# EasyEDA Pro project 交通信号灯第一版.epro

# Schematic CORE
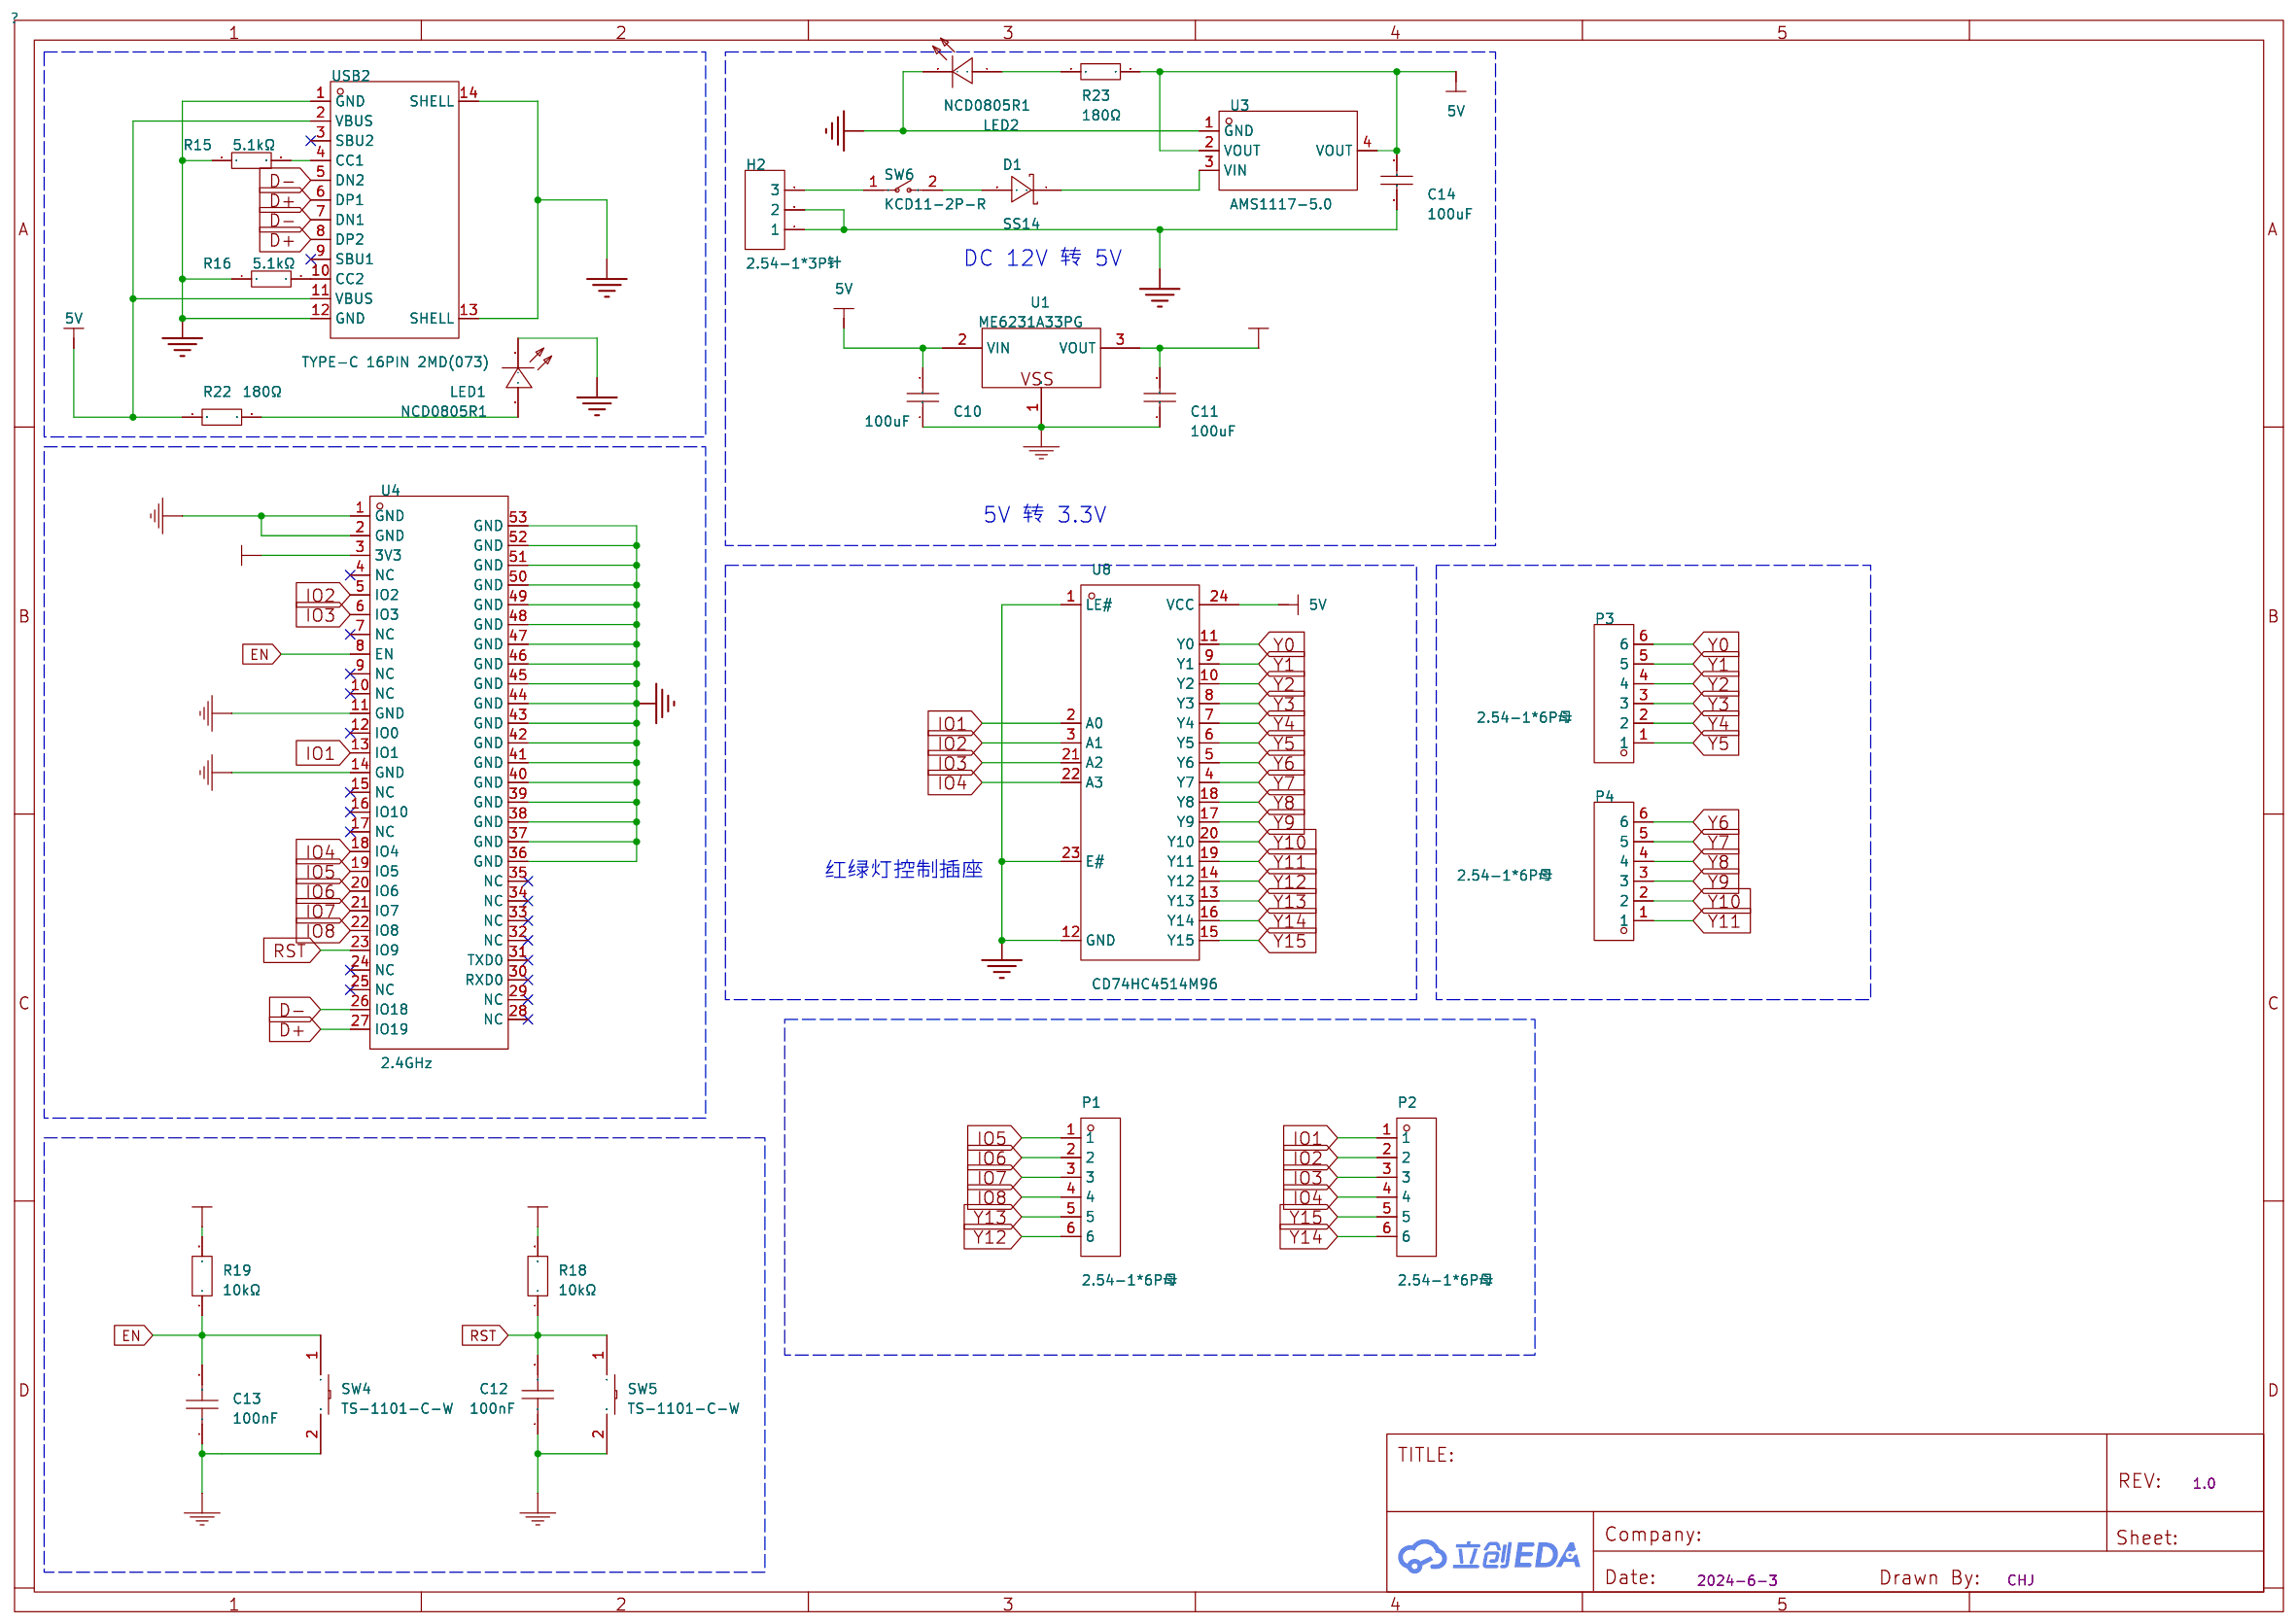
[diagram p0: schematic sheet]

## Parts
C10  100uF  [C1206]
C11  100uF  [C1206]
C12  100nF  [C0603]
C13  100nF  [C0603]
C14  100uF  [C1206]
D1  SS14  [SMA_L4.2-W2.6-LS5.3-RD]
H2  2.54-1*3P针  [HDR-TH_3P-P2.54-V-M-1]
LED1  NCD0805R1  [LED0805-R-RD]
LED2  NCD0805R1  [LED0805-R-RD]
P1  2.54-1*6P母  [HDR-TH_6P-P2.54-V-F]
P2  2.54-1*6P母  [HDR-TH_6P-P2.54-V-F]
P3  2.54-1*6P母  [HDR-TH_6P-P2.54-V-F]
P4  2.54-1*6P母  [HDR-TH_6P-P2.54-V-F]
R15  5.1kΩ  [R0603]
R16  5.1kΩ  [R0603]
R18  10kΩ  [R0603]
R19  10kΩ  [R0603]
R22  180Ω  [R0805]
R23  180Ω  [R0805]
SW4  TS-1101-C-W  [SW-SMD_L6.0-W3.3-LS8.0]
SW5  TS-1101-C-W  [SW-SMD_L6.0-W3.3-LS8.0]
SW6  KCD11-2P-R  [SW-TH_2P-L15.0-W10.5-P5.00_KCD11-2P-R]
U1  ME6231A33PG  [SOT-89-3_L4.5-W2.5-P1.50-LS4.2-BR]
U3  AMS1117-5.0  [SOT-223_L6.5-W3.5-P2.30-LS7.0-BR]
U4  2.4GHz  [WIFIM-SMD_ESP32-C3-MINI-1]
U8  CD74HC4514M96  [SOIC-24_L15.4-W7.5-P1.27-LS10.3-BL]
USB2  TYPE-C 16PIN 2MD(073)  [USB-C-SMD_TYPE-C-6PIN-2MD-073]

## Library data of the parts
C10 C11 C14 = CL31A107MQHNNNE: 容值:100uF;精度:±20%;额定电压:6.3V;材质(温度系数):X5R;; LCSC Part Name: 100uF ±20% 6.3V; Supplier Part: C15008; Manufacturer: SAMSUNG(三星); Supplier Footprint: 1206; JLCPCB Part Class: 基础库; Datasheet: https://atta.szlcsc.com/upload/public/pdf/source/20160218/1457707763339.pdf; Supplier: LCSC; Tolerance: ±20%; Voltage Rated: 6.3V; Temperature Coefficient: X5R
C12 C13 = CC0603KRX7R9BB104: 容值:100nF;精度:±10%;额定电压:50V;材质(温度系数):X7R;; LCSC Part Name: 100nF ±10% 50V; Supplier Part: C14663; Manufacturer: YAGEO(国巨); Supplier Footprint: 0603; JLCPCB Part Class: 基础库; Datasheet: https://atta.szlcsc.com/upload/public/pdf/source/20180910/C282072_33301C7F631E79921B82A8DAC6BCC5B3.pdf; Supplier: LCSC; Tolerance: ±10%; Voltage Rated: 50V; Temperature Coefficient: X7R
D1 = SS14_C2480: 二极管配置:独立式;正向压降(Vf):550mV@1A;直流反向耐压(Vr):40V;平均整流电流(Io):1A;; LCSC Part Name: 电压:40V 电流:1A; Supplier Part: C2480; Manufacturer: MDD; Supplier Footprint: SMA(DO-214AC); JLCPCB Part Class: 基础库; Datasheet: https://atta.szlcsc.com/upload/public/pdf/source/20230712/2DB6064CFBB99DE6DB116BEE8208BE66.pdf; Supplier: LCSC; Diode Configuration: 独立式; Forward Voltage (Vf@If): 550mV@1A; Reverse Voltage (Vr): 40V; Average Rectified Current (Io): 1A; Reverse Leakage Current (Ir): 500uA@40V
H2 = 2.54-1*3P针: 插针结构:1x3P;间距:2.54mm;行距:-;圆针/方针:方针;安装类型:直插;排数:单排;总PIN位数:3P;额定电流:3A;额定电压:-;配合针长度:-;塑高:-;端接针长度:-;触头材质:-;触头镀层:-;工作温度范围:-40℃~+105℃;颜色:黑色;; LCSC Part Name: 间距:2.54mm 1x3P 直插 方针; Supplier Part: C49257; Manufacturer: BOOMELE(博穆精密); Supplier Footprint: 插件,P=2.54mm; JLCPCB Part Class: 扩展库; Datasheet: https://atta.szlcsc.com/upload/public/pdf/source/20221018/3E9408392E35E6F57A28985E5F7BF5C9.pdf; Supplier: LCSC; Pin Structure: 1x3P; Pitch: 2.54mm; Circluar Pins/Square Pins: 方针; Mounting Type: 直插; Number of Rows: 单排; Number of Pins: 3P; Current Rating (Max): 3A; Operating Temperature Range: -40℃~+105℃; Color: 黑色
LED1 LED2 = NCD0805R1: 灯头类型:-;发光颜色:红色;正向电压(VF):1.6V~2.6V;功率:65mW;正向电流:20mA;主波长:615nm~630nm;二极管配置:独立二极管;透镜颜色:无色透明透镜;色温:-;发光强度:67mcd~195mcd;发光角度:130°;载带方式:-;工作温度:-30℃~+85℃;; Supplier Part: C84256; Manufacturer: 国星光电; Supplier Footprint: 0805; JLCPCB Part Class: 基础库; Datasheet: https://atta.szlcsc.com/upload/public/pdf/source/20200820/C84256_F0A75A43B3EAD75808600A0514C76B99.pdf; Supplier: LCSC; Emitted Color: 红色; Forward Voltage (VF): 1.6V~2.6V; Power Dissipation: 65mW; Forward Current: 20mA; Dominant Wavelength: 615nm~630nm; Diode Configuration: 独立二极管; Lens Color: 无色透明透镜; Luminous Intensity: 67mcd~195mcd; Viewing Angle: 130°; Operating Temperature: -30℃~+85℃
P1-P4 = 2.54-1*6P母: 插孔结构:1x6P;间距:2.54mm;行距:-;安装类型:直插;排数:单排;总孔位数:6P;塑高:-;触头材质:-;触头镀层:-;; LCSC Part Name: 间距:2.54mm 1x6P 直插; Supplier Part: C40877; Manufacturer: BOOMELE(博穆精密); Supplier Footprint: 插件,P=2.54mm; JLCPCB Part Class: 扩展库; Datasheet: https://atta.szlcsc.com/upload/public/pdf/source/20210301/C2718488_F4427B881E42CAA8DDB0B1C12B3A522C.pdf; Supplier: LCSC; Holes Structure: 1x6P; Pitch: 2.54mm; Mounting Type: 直插; Number of Rows: 单排; Number of Holes: 6P
R15 R16 = 0603WAF5101T5E: 电阻类型:厚膜电阻;阻值:5.1kΩ;精度:±1%;功率:100mW;最大工作电压:75V;温度系数:±100ppm/℃;; LCSC Part Name: 5.1kΩ ±1% 100mW 厚膜电阻; Supplier Part: C23186; Manufacturer: UNI-ROYAL(厚声); Supplier Footprint: 0603; JLCPCB Part Class: 基础库; Datasheet: https://atta.szlcsc.com/upload/public/pdf/source/20200306/C422600_1E6D84923E4A46A82E41ADD87F860B5C.pdf; Supplier: LCSC; Type: 厚膜电阻; Tolerance: ±1%; Power(Watts): 100mW; Overload Voltage (Max): 75V; Temperature Coefficient: ±100ppm/℃; Operating Temperature Range: -55℃~+155℃
R18 R19 = FRC0603J103TS: 电阻类型:厚膜电阻;阻值:10kΩ;精度:±5%;功率:100mW;最大工作电压:75V;温度系数:±100ppm/℃;; LCSC Part Name: 10kΩ ±5% 100mW 厚膜电阻; Supplier Part: C2930027; Manufacturer: FOJAN(富捷); Supplier Footprint: 0603; JLCPCB Part Class: 扩展库; Datasheet: https://atta.szlcsc.com/upload/public/pdf/source/20211221/925EC7D7225764EE0046F22065062C87.pdf; Supplier: LCSC; Type: 厚膜电阻; Tolerance: ±5%; Power(Watts): 100mW; Overload Voltage (Max): 75V; Temperature Coefficient: ±100ppm/℃; Operating Temperature Range: -55℃~+155℃
R22 R23 = 0805W8F1800T5E: 电阻类型:厚膜电阻;阻值:180Ω;精度:±1%;功率:125mW;最大工作电压:150V;温度系数:±100ppm/℃;; LCSC Part Name: 180Ω ±1% 125mW 厚膜电阻; Supplier Part: C25270; Manufacturer: UNI-ROYAL(厚声); Supplier Footprint: 0805; JLCPCB Part Class: 扩展库; Datasheet: https://atta.szlcsc.com/upload/public/pdf/source/20200306/C422600_1E6D84923E4A46A82E41ADD87F860B5C.pdf; Supplier: LCSC; Type: 厚膜电阻; Tolerance: ±1%; Power(Watts): 125mW; Overload Voltage (Max): 150V; Temperature Coefficient: ±100ppm/℃; Operating Temperature Range: -55℃~+155℃
SW4 SW5 = TS-1101-C-W: 电路结构:单刀单掷;按钮形状:矩形按钮;作用力:260gf;安装方式:立贴;开关长度:6mm;开关宽度:3.6mm;开关高度:2.5mm;带支架:不带;触点电流:50mA;额定电压(AC):-;额定电压(DC):12V;额定功率:-;绝缘电阻:-;带灯:无;机械寿命:5万次;; LCSC Part Name: 6*3.6*2.5mm 立贴 轻触开关; Supplier Part: C318938; Manufacturer: XKB Connectivity(中国星坤); Supplier Footprint: SMD; JLCPCB Part Class: 扩展库; Datasheet: https://atta.szlcsc.com/upload/public/pdf/source/20200227/C318938_C2E53B1EEDE37D980A33616AC086DE53.pdf; Supplier: LCSC; Circuit: 单刀单掷; Actuator Style: 矩形按钮; Operating Force: 260gf; Mounting Style: 立贴; Switch Length: 6mm; Switch Width: 3.6mm; Switch Height: 2.5mm; Strike Gundam: 不带; Contact Current: 50mA; Voltage Rating (DC): 12V; Actuator/Cap Color: 白色带淡绿; With Lamp: 无; Mechanical Life: 5万次; Operating Temperature: -30℃~+85℃
SW6 = KCD11-2P-R: 带灯:无;引脚样式:焊片;额定电流:3A;额定电压(AC):250V;额定电压(DC):-;电路结构:单刀单掷;机械寿命:1万次;; LCSC Part Name: 10.5*15mm 两脚两档跷板开关 红钮; Supplier Part: C5884414; Manufacturer: SHOU HAN(首韩); Supplier Footprint: 插件; JLCPCB Part Class: 扩展库; Datasheet: https://atta.szlcsc.com/upload/public/pdf/source/20230506/CD06DFDE35C8048D34175BFF4AF6A2C2.pdf; Supplier: LCSC; Switch Length: 15mm; Switch Width: 10.5mm; Switch Height: 17.2mm; Actuator Type: 凹面弯曲; With Lamp: 无; Pin Style: 焊片; Actuator Color: 红色; Contact Current: 3A; Voltage Rating (AC): 250V; Circuit: 单刀单掷; Mechanical Life: 1万次; Operating Temperature: 0℃~+125℃; Actuator Identifier: - O
U1 = ME6231A33PG: Supplier: LCSC; Supplier Part: C2681684; Manufacturer: MICRONE(南京微盟); JLCPCB Part Class: Extended Part
U3 = AMS1117-5.0_C6187: 输出类型:固定;最大输入电压:12V;输出电压:5V;最大输出电流:1A;电源纹波抑制比(PSRR):68dB@(120Hz);输出极性:正极;; LCSC Part Name: 输入12V 输出5V 1A; Supplier Part: C6187; Manufacturer: AMS; Supplier Footprint: SOT-223; JLCPCB Part Class: 基础库; Datasheet: https://atta.szlcsc.com/upload/public/pdf/source/20230918/E4B716057EE82179D88E8A0894830D59.pdf; Supplier: LCSC; Output Type: 固定; Maximum Input Voltage: 12V; Output Voltage: 5V; MAX Output Current: 1A; Power Supply Rejection Ratio (PSRR): 68dB@(120Hz); Dropout Voltage: 1.3V@(1A); Output Polarity: 正极; Number of Outputs: 1
U4 = ESP32-C3-MINI-1-H4: 核心处理器:-;频率:2.4GHz;天线形式:板载PCB天线;发射功率:20.5dBm;接收灵敏度:-96dBm;; Supplier Part: C2934569; Manufacturer: ESPRESSIF(乐鑫); Supplier Footprint: SMD,13.2x16.6mm; JLCPCB Part Class: 扩展库; Datasheet: https://atta.szlcsc.com/upload/public/pdf/source/20211222/4A6E563D9536B67D492463D36DD57C1D.pdf; Supplier: LCSC; Support Interface: SPI; Antenna Type: 板载PCB天线; Output Power: 20.5dBm; Operating Voltage: 3.3V; Sensitivity: -96dBm; Operating Temperature: -40℃~+85℃
U8 = CD74HC4514M96: 供电电压:2V~6V;灌电流(IOL):5.2mA;拉电流(IOH):5.2mA;; Supplier Part: C6549; Manufacturer: TI(德州仪器); Supplier Footprint: SOIC-24-300mil; JLCPCB Part Class: 扩展库; Datasheet: https://www.ti.com/cn/lit/gpn/cd74hc4514; Supplier: LCSC; Type: 解码器/多路分解器; Voltage Supply Source: 单电源; Supply Voltage: 2V~6V; Sink Current: 5.2mA; Source Current: 5.2mA; Operating temperature: -55℃~+125℃
USB2 = TYPE-C 16PIN 2MD(073): 连接器类型:Type-C;标准:-;公母:母;端口数量:1;触点数量:16P;安装方式:卧贴;额定电流 - 电源:5A;工作温度范围:-25℃~+85℃;; LCSC Part Name: Type-C 母 卧贴; Supplier Part: C2765186; Manufacturer: SHOU HAN(首韩); Supplier Footprint: SMD; JLCPCB Part Class: 扩展库; Datasheet: https://atta.szlcsc.com/upload/public/pdf/source/20211123/39B17C16241EAC15C5E277BDA434118E.pdf; Supplier: LCSC; Connector Type: Type-C; Gender: 母; Number of Ports: 1; Number of Contacts: 16P; Mounting Style: 卧贴; Current Rating - Power (Max): 5A; Operating Temperature Range: -25℃~+85℃

## Nets
3.3V: C11.2 R18.2 R19.2 U1.3(VOUT) U4.3(3V3)
5V: C10.2 C14.2 R22.1 R23.2 U1.2(VIN) U3.2(VOUT) U3.4(VOUT) U8.24(VCC) USB2.2(VBUS) USB2.11(VBUS)
GND: C10.1 C11.1 C12.1 C13.1 C14.1 H2.1 H2.2 LED1.2(-) LED2.2(-) R15.1 R16.1 SW4.2 SW5.2 U1.1(VSS) U3.1(GND) U4.1(GND) U4.2(GND) U4.11(GND) U4.14(GND) U4.36(GND) U4.37(GND) U4.38(GND) U4.39(GND) U4.40(GND) U4.41(GND) U4.42(GND) U4.43(GND) U4.44(GND) U4.45(GND) U4.46(GND) U4.47(GND) U4.48(GND) U4.49(GND) U4.50(GND) U4.51(GND) U4.52(GND) U4.53(GND) U8.1(LE#) U8.12(GND) U8.23(E#) USB2.1(GND) USB2.12(GND) USB2.13(SHELL) USB2.14(SHELL)
D+: U4.27(IO19) USB2.6(DP1) USB2.8(DP2)
D-: U4.26(IO18) USB2.5(DN2) USB2.7(DN1)
EN: C13.2 R19.1 SW4.1 U4.8(EN)
IO1: P2.1 U4.13(IO1) U8.2(A0)
IO2: P2.2 U4.5(IO2) U8.3(A1)
IO3: P2.3 U4.6(IO3) U8.21(A2)
IO4: P2.4 U4.18(IO4) U8.22(A3)
IO5: P1.1 U4.19(IO5)
IO6: P1.2 U4.20(IO6)
IO7: P1.3 U4.21(IO7)
IO8: P1.4 U4.22(IO8)
RST: C12.2 R18.1 SW5.1 U4.23(IO9)
Y0: P3.6 U8.11(Y0)
Y1: P3.5 U8.9(Y1)
Y2: P3.4 U8.10(Y2)
Y3: P3.3 U8.8(Y3)
Y4: P3.2 U8.7(Y4)
Y5: P3.1 U8.6(Y5)
Y6: P4.6 U8.5(Y6)
Y7: P4.5 U8.4(Y7)
Y8: P4.4 U8.18(Y8)
Y9: P4.3 U8.17(Y9)
Y10: P4.2 U8.20(Y10)
Y11: P4.1 U8.19(Y11)
Y12: P1.6 U8.14(Y12)
Y13: P1.5 U8.13(Y13)
Y14: P2.6 U8.16(Y14)
Y15: P2.5 U8.15(Y15)
$1N7275: R15.2 USB2.4(CC1)
$1N7277: R16.2 USB2.10(CC2)
$1N9476: LED1.1(+) R22.2
$1N10832: H2.3 SW6.1
$1N11019: LED2.1(+) R23.1
$1N19881: D1.1(K) U3.3(VIN)
$1N19882: D1.2(A) SW6.2

Not connected (* = marked no-connect by the designer): U4 4(NC)* 7(NC)* 9(NC)* 10(NC)* 12(IO0)* 15(NC)* 16(IO10)* 17(NC)* 24(NC)* 25(NC)* 28(NC)* 29(NC)* 30(RXD0)* 31(TXD0)* 32(NC)* 33(NC)* 34(NC)* 35(NC)*; USB2 3(SBU2)* 9(SBU1)*

## Notes on the sheet
- DC 12V 转 5V
- 5V 转 3.3V
- 红绿灯控制插座

# Board CORE
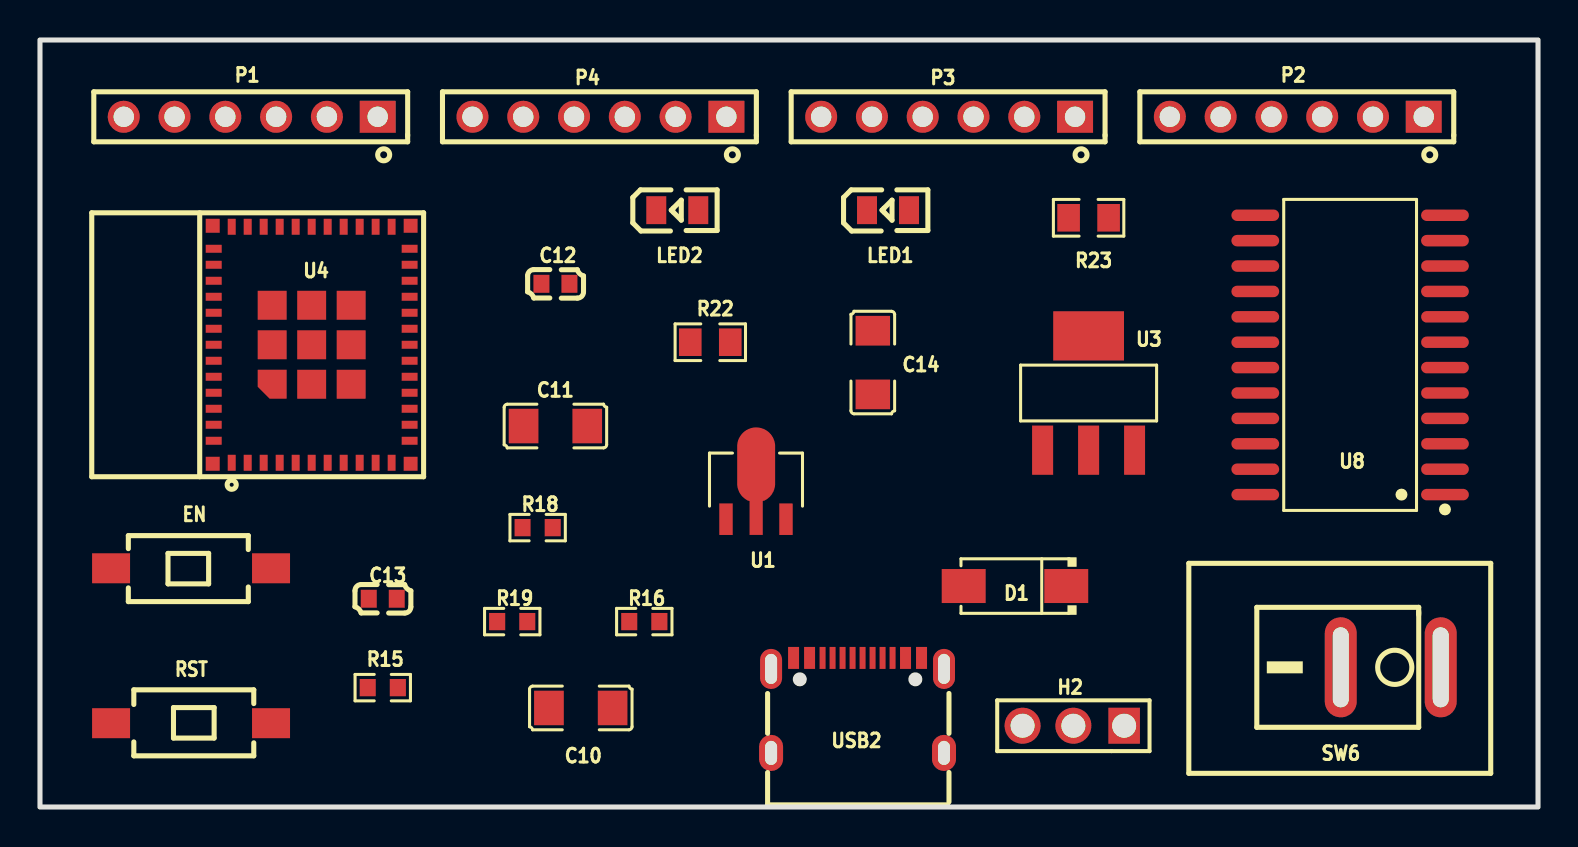
[diagram p1: board, top side]
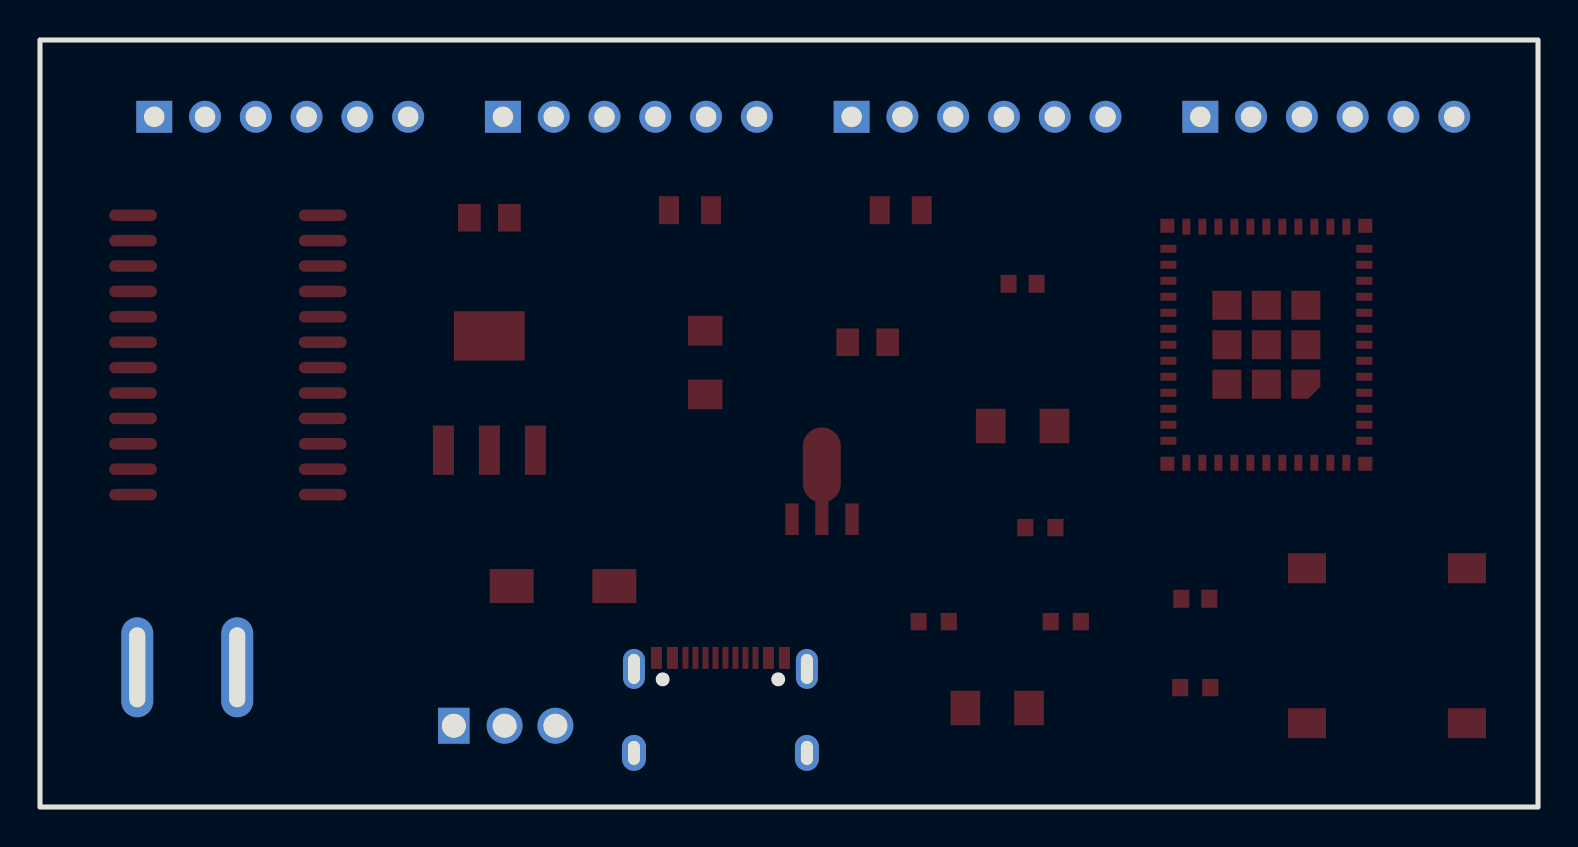
[diagram p2: board, bottom side, seen from below]

Outline 74.93 x 38.35 mm; copper layers: Top Layer, Bottom Layer. Coordinates in mm from the lower left corner of the outline.
Outline path: rectangle 0,38.35 74.93,0
Stack: Top Layer 0.035mm / Dielectric1 1.51mm FR4 er 4.5 / Bottom Layer 0.035mm

## Design rules (mm)
spacing Default (default): track to track 0.152, other pairs 0 to 0.152
track width Default (default): min 0.254, default 0.254, max 25.4
differential pair differentialPair (default): width min 0.127, default 0.254, max 2.54; gap min 0.152, default 0.152
via Default (default): diameter min 0.61, default 0.61, max 100.025; hole min 0.305, default 0.305, max 59.995
net GND uses gge33061

## Placement (name value [footprint] x y rotation side)
C10  100uF  [C1206]  27.05 4.95 0 top
C11  100uF  [C1206]  25.78 19.05 0 top
C12  100nF  [C0603]  25.78 26.16 180 top
C13  100nF  [C0603]  17.14 10.41 180 top
C14  100uF  [C1206]  41.66 22.22 270 top
D1  SS14  [SMA_L4.2-W2.6-LS5.3-RD]  48.77 11.05 180 top
H2  2.54-1*3P针  [HDR-TH_3P-P2.54-V-M-1]  51.69 4.06 180 top
LED1  NCD0805R1  [LED0805-R-RD]  42.42 29.84 0 top
LED2  NCD0805R1  [LED0805-R-RD]  31.88 29.84 0 top
P1  2.54-1*6P母  [HDR-TH_6P-P2.54-V-F]  10.54 34.51 180 top
P2  2.54-1*6P母  [HDR-TH_6P-P2.54-V-F]  62.86 34.51 180 top
P3  2.54-1*6P母  [HDR-TH_6P-P2.54-V-F]  45.42 34.51 180 top
P4  2.54-1*6P母  [HDR-TH_6P-P2.54-V-F]  27.98 34.51 180 top
R15  5.1kΩ  [R0603]  17.14 5.97 0 top
R16  5.1kΩ  [R0603]  30.23 9.27 0 top
R18  10kΩ  [R0603]  24.89 13.97 0 top
R19  10kΩ  [R0603]  23.62 9.27 0 top
R22  180Ω  [R0805]  33.53 23.24 180 top
R23  180Ω  [R0805]  52.45 29.46 180 top
SW4  TS-1101-C-W  [SW-SMD_L6.0-W3.3-LS8.0]  7.56 11.94 0 top
SW5  TS-1101-C-W  [SW-SMD_L6.0-W3.3-LS8.0]  7.56 4.19 180 top
SW6  KCD11-2P-R  [SW-TH_2P-L15.0-W10.5-P5.00_KCD11-2P-R]  67.56 6.98 180 top
U1  ME6231A33PG  [SOT-89-3_L4.5-W2.5-P1.50-LS4.2-BR]  35.81 15.75 270 top
U3  AMS1117-5.0  [SOT-223_L6.5-W3.5-P2.30-LS7.0-BR]  52.45 20.7 270 top
U4  2.4GHz  [WIFIM-SMD_ESP32-C3-MINI-1]  13.59 23.11 90 top
U8  CD74HC4514M96  [SOIC-24_L15.4-W7.5-P1.27-LS10.3-BL]  65.53 22.61 90 top
USB2  TYPE-C 16PIN 2MD(073)  [USB-C-SMD_TYPE-C-6PIN-2MD-073]  40.89 5.08 0 top

## Footprints (pads in the part's own frame, mm; a bottom-side part is the same pattern mirrored in y, then rotated)
C0603
  rect 0.8x0.9 smd: 1(-0.7,0) 2(0.7,0)
C1206
  rect 1.485x1.728 smd: 1(-1.593,0) 2(1.593,0)
HDR-TH_3P-P2.54-V-M-1
  rect 1.575x1.8 hole 1.2: 1(-2.54,0)
  round 1.8 hole 1.2: 2(0,0) 3(2.54,0)
HDR-TH_6P-P2.54-V-F
  rect 1.8x1.6 hole 1.02: 1(-6.35,0)
  round 1.6 hole 1.02: 2(-3.81,0) 3(-1.27,0) 4(1.27,0) 5(3.81,0) 6(6.35,0)
LED0805-R-RD
  rect 1x1.399 smd: 1(1.05,0) 2(-1.05,0)
R0603
  rect 0.806x0.864 smd: 1(-0.753,0) 2(0.753,0)
R0805
  rect 1.133x1.377 smd: 1(-1,0) 2(1,0)
SMA_L4.2-W2.6-LS5.3-RD
  rect 2.2x1.7 smd: 1(-2.566,0) 2(2.566,0)
SOIC-24_L15.4-W7.5-P1.27-LS10.3-BL
  oval 0.574x2.388 smd: 1(-6.985,-4.744) 2(-5.715,-4.744) 3(-4.445,-4.744) 4(-3.175,-4.744) 5(-1.905,-4.744) 6(-0.635,-4.744) 7(0.635,-4.744) 8(1.905,-4.744) 9(3.175,-4.744) 10(4.445,-4.744) 11(5.715,-4.744) 12(6.985,-4.744) 13(6.985,4.744) 14(5.715,4.744) 15(4.445,4.744) 16(3.175,4.744) 17(1.905,4.744) 18(0.635,4.744) 19(-0.635,4.744) 20(-1.905,4.744) 21(-3.175,4.744) 22(-4.445,4.744) 23(-5.715,4.744) 24(-6.985,4.744)
SOT-89-3_L4.5-W2.5-P1.50-LS4.2-BR
  rect 1.575x0.672 smd: 1(1.357,-1.5) 3(1.357,1.5)
  custom 5.377x1.9 smd: 2(-1.356,0.009)
SOT-223_L6.5-W3.5-P2.30-LS7.0-BR
  rect 2.465x1.05 smd: 1(2.857,-2.3) 2(2.857,0) 3(2.857,2.3)
  rect 2.465x3.54 smd: 4(-2.857,0)
SW-SMD_L6.0-W3.3-LS8.0
  rect 1.9x1.5 smd: 1(-4,0) 2(4,0)
SW-TH_2P-L15.0-W10.5-P5.00_KCD11-2P-R
  oval 1.6x5 hole 0.8x4: 1(-2.5,0) 2(2.5,0)
USB-C-SMD_TYPE-C-6PIN-2MD-073
  rect 0.55x1.1 smd: 1(-3.2,2.375) 2(-2.4,2.375) 11(2.4,2.375) 12(3.2,2.375)
  rect 0.3x1.1 smd: 3(-1.75,2.375) 4(-1.25,2.375) 5(-0.75,2.375) 6(-0.25,2.375) 7(0.25,2.375) 8(0.75,2.375) 9(1.25,2.375) 10(1.75,2.375)
  oval 1.1x2 hole 0.6x1.5: 13(-4.325,1.825) 14(4.325,1.825)
  oval 1.2x1.8 hole 0.6x1.2: 13(-4.325,-2.375) 14(4.325,-2.375)
WIFIM-SMD_ESP32-C3-MINI-1
  rect 0.8x0.4 smd: 1(-5.9,4) 2(-5.9,3.2) 3(-5.9,2.4) 4(-5.9,1.6) 5(-5.9,0.8) 6(-5.9,0) 7(-5.9,-0.8) 8(-5.9,-1.6) 9(-5.9,-2.4) 10(-5.9,-3.2) 11(-5.9,-4) 25(5.9,-4) 26(5.9,-3.2) 27(5.9,-2.4) 28(5.9,-1.6) 29(5.9,-0.8) 30(5.9,0) 31(5.9,0.8) 32(5.9,1.6) 33(5.9,2.4) 34(5.9,3.2) 35(5.9,4)
  rect 0.4x0.8 smd: 12(-4.8,-4.9) 13(-4,-4.9) 14(-3.2,-4.9) 15(-2.4,-4.9) 16(-1.6,-4.9) 17(-0.8,-4.9) 18(0,-4.9) 19(0.8,-4.9) 20(1.6,-4.9) 21(2.4,-4.9) 22(3.2,-4.9) 23(4,-4.9) 24(4.8,-4.9) 36(4.8,4.9) 37(4,4.9) 38(3.2,4.9) 39(2.4,4.9) 40(1.6,4.9) 41(0.8,4.9) 42(0,4.9) 43(-0.8,4.9) 44(-1.6,4.9) 45(-2.4,4.9) 46(-3.2,4.9) 47(-4,4.9) 48(-4.8,4.9)
  custom 1.45x1.45 smd: 49(-1.975,1.975)
  rect 1.45x1.45 smd: 49(-1.975,0) 49(-1.975,-1.975) 49(0,1.975) 49(0,0) 49(0,-1.975) 49(1.975,1.975) 49(1.975,0) 49(1.975,-1.975)
  rect 0.7x0.7 smd: 50(5.95,4.95) 51(5.95,-4.95) 52(-5.95,-4.95) 53(-5.95,4.95)

## Nets
As in the schematic.

Pads without a net: U4 4 7 9 10 12 15 16 17 24 25 28 29 30 31 32 33 34 35; USB2 3 9

## Text on the board
Top Silkscreen Layer: RST | EN
